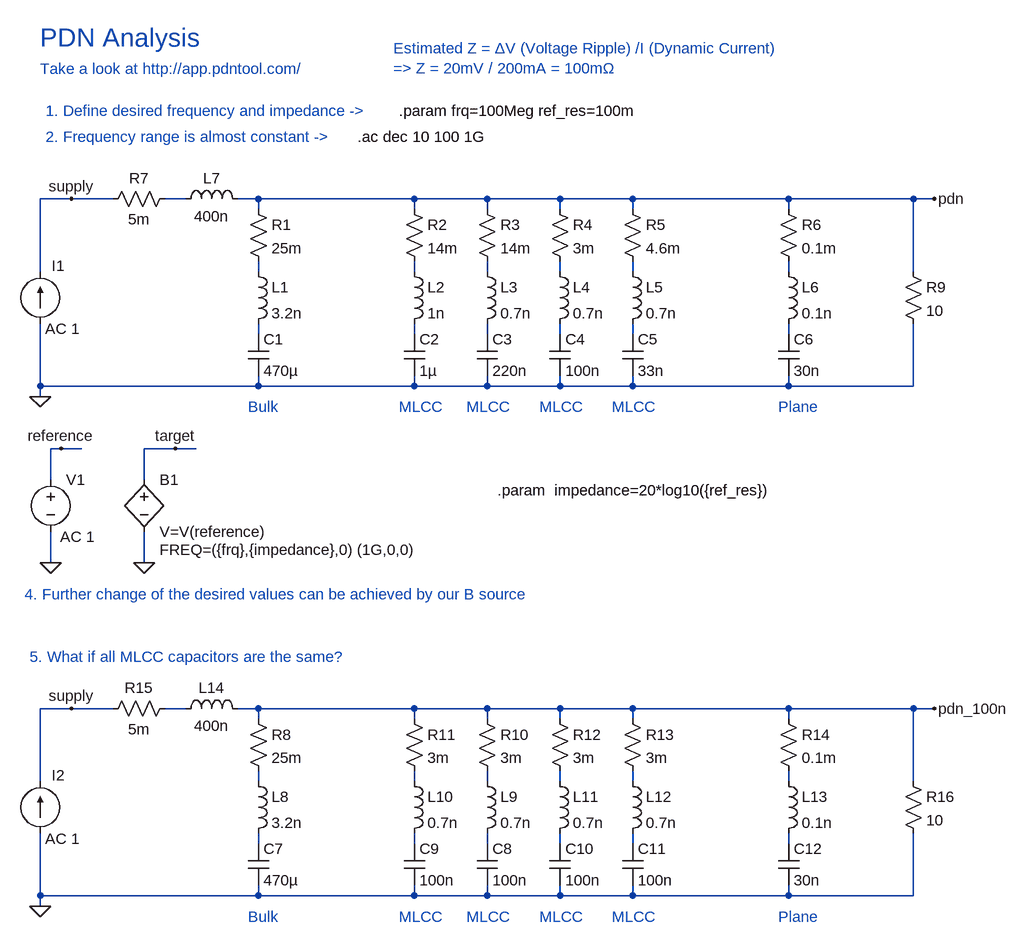
[diagram p0: schematic 01-simple_model.asc]
01-simple_model.asc, the LTspice schematic file:
Version 4
SHEET 1 1544 1184
WIRE 0 64 -48 64
WIRE 64 64 0 64
WIRE 176 64 144 64
WIRE 288 64 256 64
WIRE 528 64 288 64
WIRE 640 64 528 64
WIRE 752 64 640 64
WIRE 864 64 752 64
WIRE 1104 64 864 64
WIRE 1296 64 1104 64
WIRE 1328 64 1296 64
WIRE 288 80 288 64
WIRE 528 80 528 64
WIRE 640 80 640 64
WIRE 752 80 752 64
WIRE 864 80 864 64
WIRE 1104 80 1104 64
WIRE -48 176 -48 64
WIRE 288 176 288 160
WIRE 528 176 528 160
WIRE 640 176 640 160
WIRE 752 176 752 160
WIRE 864 176 864 160
WIRE 1104 176 1104 160
WIRE 1296 176 1296 64
WIRE 288 272 288 256
WIRE 528 272 528 256
WIRE 640 272 640 256
WIRE 752 272 752 256
WIRE 864 272 864 256
WIRE 1104 272 1104 256
WIRE -48 352 -48 256
WIRE 288 352 288 336
WIRE 288 352 -48 352
WIRE 528 352 528 336
WIRE 528 352 288 352
WIRE 640 352 640 336
WIRE 640 352 528 352
WIRE 752 352 752 336
WIRE 752 352 640 352
WIRE 864 352 864 336
WIRE 864 352 752 352
WIRE 1104 352 1104 336
WIRE 1104 352 864 352
WIRE 1296 352 1296 256
WIRE 1296 352 1104 352
WIRE -48 368 -48 352
WIRE -16 448 -32 448
WIRE 16 448 -16 448
WIRE 160 448 112 448
WIRE 192 448 160 448
WIRE -32 496 -32 448
WIRE 112 496 112 448
WIRE -32 624 -32 576
WIRE 112 624 112 576
WIRE 0 848 -48 848
WIRE 64 848 0 848
WIRE 176 848 144 848
WIRE 288 848 256 848
WIRE 528 848 288 848
WIRE 640 848 528 848
WIRE 752 848 640 848
WIRE 864 848 752 848
WIRE 1104 848 864 848
WIRE 1296 848 1104 848
WIRE 1328 848 1296 848
WIRE 288 864 288 848
WIRE 528 864 528 848
WIRE 640 864 640 848
WIRE 752 864 752 848
WIRE 864 864 864 848
WIRE 1104 864 1104 848
WIRE -48 960 -48 848
WIRE 288 960 288 944
WIRE 528 960 528 944
WIRE 640 960 640 944
WIRE 752 960 752 944
WIRE 864 960 864 944
WIRE 1104 960 1104 944
WIRE 1296 960 1296 848
WIRE 288 1056 288 1040
WIRE 528 1056 528 1040
WIRE 640 1056 640 1040
WIRE 752 1056 752 1040
WIRE 864 1056 864 1040
WIRE 1104 1056 1104 1040
WIRE -48 1136 -48 1040
WIRE 288 1136 288 1120
WIRE 288 1136 -48 1136
WIRE 528 1136 528 1120
WIRE 528 1136 288 1136
WIRE 640 1136 640 1120
WIRE 640 1136 528 1136
WIRE 752 1136 752 1120
WIRE 752 1136 640 1136
WIRE 864 1136 864 1120
WIRE 864 1136 752 1136
WIRE 1104 1136 1104 1120
WIRE 1104 1136 864 1136
WIRE 1296 1136 1296 1040
WIRE 1296 1136 1104 1136
WIRE -48 1152 -48 1136
FLAG -48 368 0
FLAG 1328 64 pdn
FLAG 0 64 supply
FLAG -32 624 0
FLAG -16 448 reference
FLAG 112 624 0
FLAG 160 448 target
FLAG -48 1152 0
FLAG 1328 848 pdn_100n
FLAG 0 848 supply
SYMBOL res 272 64 R0
SYMATTR InstName R1
SYMATTR Value 25m
SYMBOL ind 272 160 R0
SYMATTR InstName L1
SYMATTR Value 3.2n
SYMBOL cap 272 272 R0
SYMATTR InstName C1
SYMATTR Value 470µ
SYMBOL current -48 256 R180
WINDOW 0 -38 89 Left 2
WINDOW 3 24 0 Left 2
WINDOW 123 -61 -8 Left 2
WINDOW 39 0 0 Left 0
SYMATTR InstName I1
SYMATTR Value ""
SYMATTR Value2 AC 1
SYMBOL res 512 64 R0
SYMATTR InstName R2
SYMATTR Value 14m
SYMBOL ind 512 160 R0
SYMATTR InstName L2
SYMATTR Value 1n
SYMBOL cap 512 272 R0
SYMATTR InstName C2
SYMATTR Value 1µ
SYMBOL res 624 64 R0
SYMATTR InstName R3
SYMATTR Value 14m
SYMBOL ind 624 160 R0
SYMATTR InstName L3
SYMATTR Value 0.7n
SYMBOL cap 624 272 R0
SYMATTR InstName C3
SYMATTR Value 220n
SYMBOL res 736 64 R0
SYMATTR InstName R4
SYMATTR Value 3m
SYMBOL ind 736 160 R0
SYMATTR InstName L4
SYMATTR Value 0.7n
SYMBOL cap 736 272 R0
SYMATTR InstName C4
SYMATTR Value 100n
SYMBOL res 848 64 R0
SYMATTR InstName R5
SYMATTR Value 4.6m
SYMBOL ind 848 160 R0
SYMATTR InstName L5
SYMATTR Value 0.7n
SYMBOL cap 848 272 R0
SYMATTR InstName C5
SYMATTR Value 33n
SYMBOL res 1088 64 R0
SYMATTR InstName R6
SYMATTR Value 0.1m
SYMBOL ind 1088 160 R0
SYMATTR InstName L6
SYMATTR Value 0.1n
SYMBOL cap 1088 272 R0
SYMATTR InstName C6
SYMATTR Value 30n
SYMBOL res 160 48 R90
WINDOW 0 0 56 VBottom 2
WINDOW 3 32 56 VTop 2
SYMATTR InstName R7
SYMATTR Value 5m
SYMBOL ind 160 80 R270
WINDOW 0 32 56 VTop 2
WINDOW 3 5 56 VBottom 2
SYMATTR InstName L7
SYMATTR Value 400n
SYMBOL res 1280 160 R0
SYMATTR InstName R9
SYMATTR Value 10
SYMBOL voltage -32 480 R0
WINDOW 123 15 104 Left 2
WINDOW 39 0 0 Left 0
SYMATTR Value2 AC 1
SYMATTR InstName V1
SYMATTR Value ""
SYMBOL bv 112 480 R0
WINDOW 123 24 124 Left 2
SYMATTR Value2 FREQ=({frq},{impedance},0) (1G,0,0)
SYMATTR InstName B1
SYMATTR Value V=V(reference)
SYMBOL res 272 848 R0
SYMATTR InstName R8
SYMATTR Value 25m
SYMBOL ind 272 944 R0
SYMATTR InstName L8
SYMATTR Value 3.2n
SYMBOL cap 272 1056 R0
SYMATTR InstName C7
SYMATTR Value 470µ
SYMBOL current -48 1040 R180
WINDOW 0 -38 89 Left 2
WINDOW 3 24 0 Left 2
WINDOW 123 -61 -8 Left 2
WINDOW 39 0 0 Left 0
SYMATTR InstName I2
SYMATTR Value ""
SYMATTR Value2 AC 1
SYMBOL res 736 848 R0
SYMATTR InstName R12
SYMATTR Value 3m
SYMBOL ind 736 944 R0
SYMATTR InstName L11
SYMATTR Value 0.7n
SYMBOL cap 736 1056 R0
SYMATTR InstName C10
SYMATTR Value 100n
SYMBOL res 1088 848 R0
SYMATTR InstName R14
SYMATTR Value 0.1m
SYMBOL ind 1088 944 R0
SYMATTR InstName L13
SYMATTR Value 0.1n
SYMBOL cap 1088 1056 R0
SYMATTR InstName C12
SYMATTR Value 30n
SYMBOL res 160 832 R90
WINDOW 0 0 56 VBottom 2
WINDOW 3 32 56 VTop 2
SYMATTR InstName R15
SYMATTR Value 5m
SYMBOL ind 160 864 R270
WINDOW 0 32 56 VTop 2
WINDOW 3 5 56 VBottom 2
SYMATTR InstName L14
SYMATTR Value 400n
SYMBOL res 1280 944 R0
SYMATTR InstName R16
SYMATTR Value 10
SYMBOL res 624 848 R0
SYMATTR InstName R10
SYMATTR Value 3m
SYMBOL ind 624 944 R0
SYMATTR InstName L9
SYMATTR Value 0.7n
SYMBOL cap 624 1056 R0
SYMATTR InstName C8
SYMATTR Value 100n
SYMBOL res 512 848 R0
SYMATTR InstName R11
SYMATTR Value 3m
SYMBOL ind 512 944 R0
SYMATTR InstName L10
SYMATTR Value 0.7n
SYMBOL cap 512 1056 R0
SYMATTR InstName C9
SYMATTR Value 100n
SYMBOL res 848 848 R0
SYMATTR InstName R13
SYMATTR Value 3m
SYMBOL ind 848 944 R0
SYMATTR InstName L12
SYMATTR Value 0.7n
SYMBOL cap 848 1056 R0
SYMATTR InstName C11
SYMATTR Value 100n
TEXT 440 -32 Left 2 !.ac dec 10 100 1G
TEXT 272 384 Left 2 ;Bulk
TEXT 504 384 Left 2 ;MLCC
TEXT 608 384 Left 2 ;MLCC
TEXT 720 384 Left 2 ;MLCC
TEXT 832 384 Left 2 ;MLCC
TEXT 1088 384 Left 2 ;Plane
TEXT 504 -72 Left 2 !.param frq=100Meg ref_res=100m
TEXT 656 512 Left 2 !.param  impedance=20*log10({ref_res})
TEXT -48 -136 Left 2 ;Take a look at http://app.pdntool.com/
TEXT -48 -184 Left 4 ;PDN Analysis
TEXT -40 -72 Left 2 ;1. Define desired frequency and impedance ->
TEXT -40 -32 Left 2 ;2. Frequency range is almost constant ->
TEXT -72 672 Left 2 ;4. Further change of the desired values can be achieved by our B source
TEXT 272 1168 Left 2 ;Bulk
TEXT 504 1168 Left 2 ;MLCC
TEXT 608 1168 Left 2 ;MLCC
TEXT 720 1168 Left 2 ;MLCC
TEXT 832 1168 Left 2 ;MLCC
TEXT 1088 1168 Left 2 ;Plane
TEXT -64 768 Left 2 ;5. What if all MLCC capacitors are the same?
TEXT 496 -168 Left 2 ;Estimated Z = ΔV (Voltage Ripple) /I (Dynamic Current)  \n=> Z = 20mV / 200mA = 100mΩ

The netlist it stands for:
* 01-simple_model.asc
R1 pdn N002 25m
L1 N002 N008 3.2n
C1 N008 0 470µ
I1 0 supply AC 1
R2 pdn N003 14m
L2 N003 N009 1n
C2 N009 0 1µ
R3 pdn N004 14m
L3 N004 N010 0.7n
C3 N010 0 220n
R4 pdn N005 3m
L4 N005 N011 0.7n
C4 N011 0 100n
R5 pdn N006 4.6m
L5 N006 N012 0.7n
C5 N012 0 33n
R6 pdn N007 0.1m
L6 N007 N013 0.1n
C6 N013 0 30n
R7 N001 supply 5m
L7 N001 pdn 400n
R9 pdn 0 10
V1 reference 0 AC 1
B1 target 0 V=V(reference) FREQ=({frq},{impedance},0) (1G,0,0)
R8 pdn_100n N015 25m
L8 N015 N021 3.2n
C7 N021 0 470µ
I2 0 supply AC 1
R12 pdn_100n N018 3m
L11 N018 N024 0.7n
C10 N024 0 100n
R14 pdn_100n N020 0.1m
L13 N020 N026 0.1n
C12 N026 0 30n
R15 N014 supply 5m
L14 N014 pdn_100n 400n
R16 pdn_100n 0 10
R10 pdn_100n N017 3m
L9 N017 N023 0.7n
C8 N023 0 100n
R11 pdn_100n N016 3m
L10 N016 N022 0.7n
C9 N022 0 100n
R13 pdn_100n N019 3m
L12 N019 N025 0.7n
C11 N025 0 100n
.ac dec 10 100 1G
* Bulk
* MLCC
* MLCC
* MLCC
* MLCC
* Plane
.param frq=100Meg ref_res=100m
.param  impedance=20*log10({ref_res})
* Take a look at http://app.pdntool.com/
* PDN Analysis
* 1. Define desired frequency and impedance ->
* 2. Frequency range is almost constant ->
* 4. Further change of the desired values can be achieved by our B source
* Bulk
* MLCC
* MLCC
* MLCC
* MLCC
* Plane
* 5. What if all MLCC capacitors are the same?
* Estimated Z = ΔV (Voltage Ripple) /I (Dynamic Current)
* => Z = 20mV / 200mA = 100mΩ
.backanno
.end